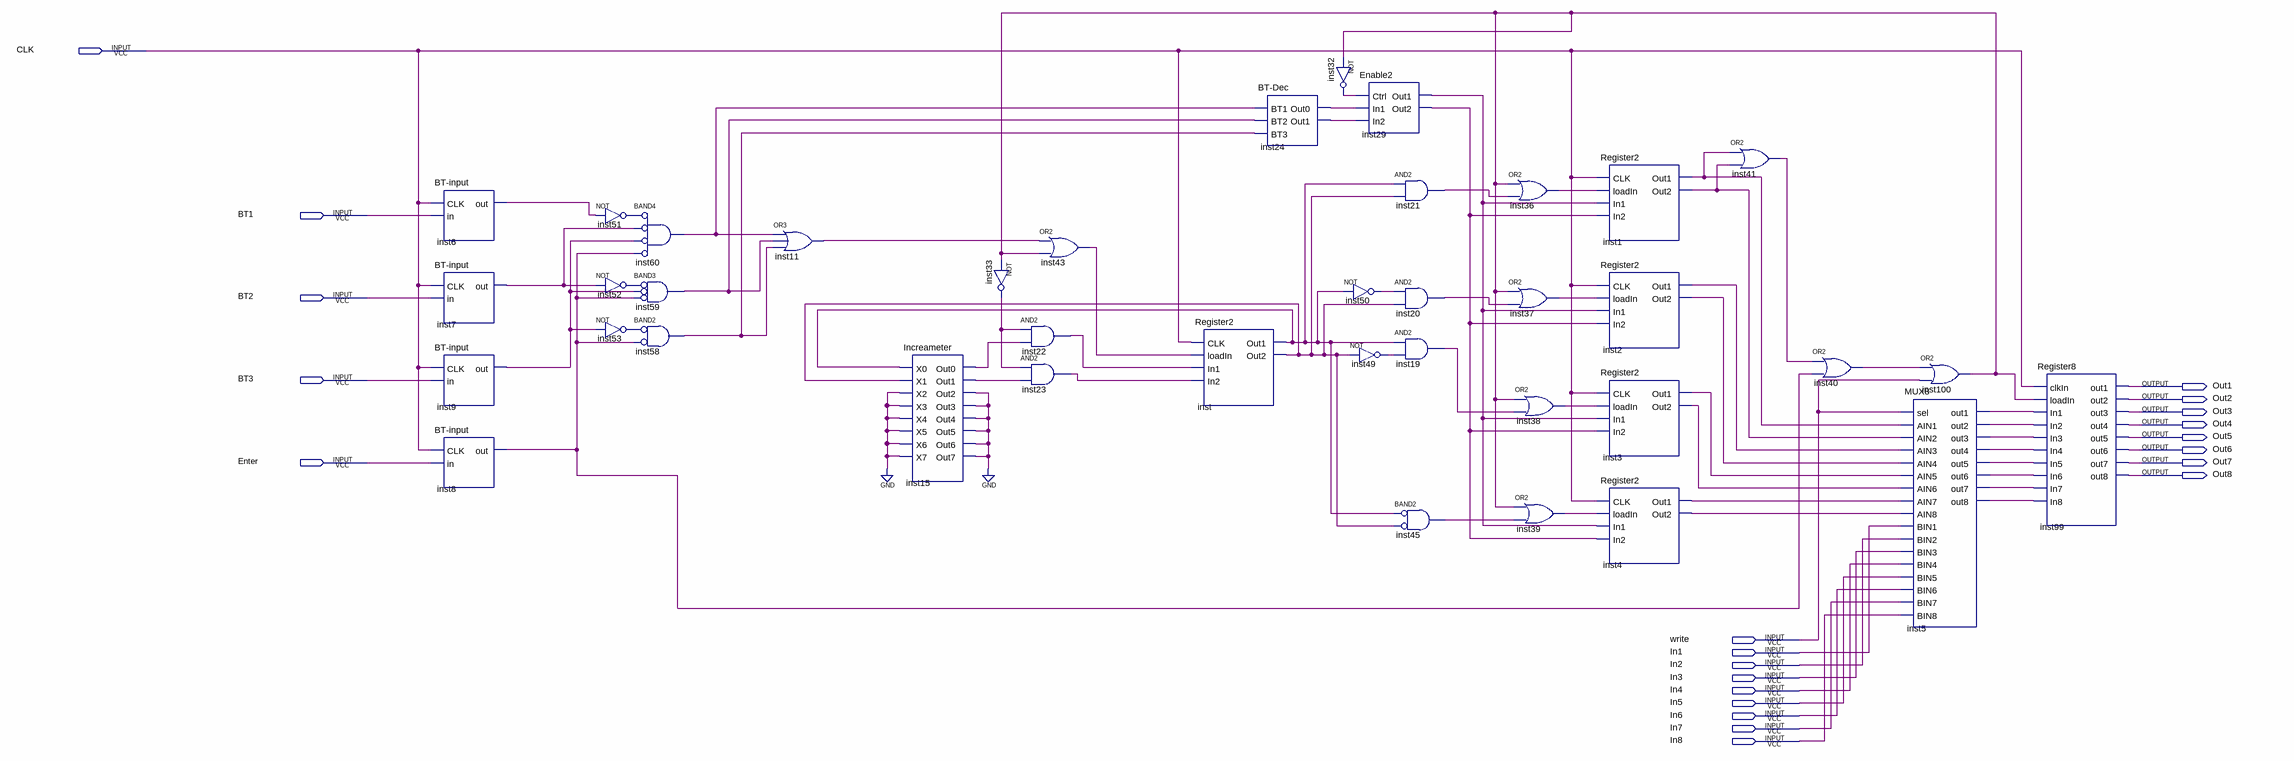
[diagram p0: schematic sheet]
// Quartus schematic InputDevice.bdf as structural Verilog: 39 symbols, 22 pins
module InputDevice (
  input  CLK,
  input  BT1,
  input  BT2,
  input  BT3,
  input  Enter,
  input  write,
  input  In1,
  input  In2,
  input  In3,
  input  In4,
  input  In5,
  input  In6,
  input  In7,
  input  In8,
  output Out1,
  output Out2,
  output Out3,
  output Out4,
  output Out5,
  output Out6,
  output Out7,
  output Out8
);

  wire inst1_out1, inst1_out2, inst2_out1, inst2_out2, inst3_out1, inst3_out2, inst4_out1, inst4_out2,
       inst5_out1, inst5_out2, inst5_out3, inst5_out4, inst5_out5, inst5_out6, inst5_out7, inst5_out8,
       inst6_out, inst7_out, inst8_out, inst9_out, inst11_out, inst15_out0, inst15_out1, inst15_out2,
       inst19_out, inst20_out, inst21_out, inst22_out, inst23_out, inst24_out0, inst24_out1, inst29_out1,
       inst29_out2, inst32_out, inst33_out, inst36_out, inst37_out, inst38_out, inst39_out, inst40_out,
       inst41_out, inst43_out, inst45_out, inst49_out, inst50_out, inst51_out, inst52_out, inst53_out,
       inst58_out, inst59_out, inst60_out, inst100_out, inst_out1, inst_out2;

  \BT-input  inst6 (.CLK(CLK), .in(BT1), .out(inst6_out));
  \BT-input  inst7 (.CLK(CLK), .in(BT2), .out(inst7_out));
  \BT-input  inst9 (.CLK(CLK), .in(BT3), .out(inst9_out));
  \BT-input  inst8 (.CLK(CLK), .in(Enter), .out(inst8_out));
  not inst51 (inst51_out, inst6_out);
  not inst52 (inst52_out, inst7_out);
  not inst53 (inst53_out, inst9_out);
  and inst60 (inst60_out, ~inst51_out, ~inst7_out, ~inst9_out, ~inst8_out);  // BAND4
  and inst59 (inst59_out, ~inst52_out, ~inst9_out, ~inst8_out);  // BAND3
  and inst58 (inst58_out, ~inst53_out, ~inst8_out);  // BAND2
  or inst11 (inst11_out, inst60_out, inst59_out, inst58_out);
  Increameter inst15 (
    .X0(inst_out1), .X1(inst_out2), .X2(1'b0), .X3(1'b0), .X4(1'b0), .X5(1'b0), .X6(1'b0), .X7(1'b0),
    .Out0(inst15_out0), .Out1(inst15_out1), .Out2(inst15_out2), .Out3(inst15_out2), .Out4(inst15_out2),
    .Out5(inst15_out2), .Out6(inst15_out2), .Out7(inst15_out2));
  not inst33 (inst33_out, inst100_out);
  and inst22 (inst22_out, inst33_out, inst15_out0);
  and inst23 (inst23_out, inst33_out, inst15_out1);
  or inst43 (inst43_out, inst11_out, inst100_out);
  Register2 inst (
    .CLK(CLK), .loadIn(inst43_out), .In1(inst22_out), .In2(inst23_out), .Out1(inst_out1), .Out2(inst_out2));
  \BT-Dec  inst24 (.BT1(inst60_out), .BT2(inst59_out), .BT3(inst58_out), .Out0(inst24_out0), .Out1(inst24_out1));
  not inst32 (inst32_out, inst100_out);
  Enable2 inst29 (.Ctrl(inst32_out), .In1(inst24_out0), .In2(inst24_out1), .Out1(inst29_out1), .Out2(inst29_out2));
  not inst50 (inst50_out, inst_out1);
  not inst49 (inst49_out, inst_out2);
  and inst21 (inst21_out, inst_out1, inst_out2);
  and inst20 (inst20_out, inst50_out, inst_out2);
  and inst19 (inst19_out, inst_out1, inst49_out);
  and inst45 (inst45_out, ~inst_out1, ~inst_out2);  // BAND2
  or inst36 (inst36_out, inst100_out, inst21_out);
  or inst37 (inst37_out, inst100_out, inst20_out);
  or inst38 (inst38_out, inst100_out, inst19_out);
  or inst39 (inst39_out, inst100_out, inst45_out);
  Register2 inst1 (
    .CLK(CLK), .loadIn(inst36_out), .In1(inst29_out1), .In2(inst29_out2), .Out1(inst1_out1), .Out2(inst1_out2));
  Register2 inst2 (
    .CLK(CLK), .loadIn(inst37_out), .In1(inst29_out1), .In2(inst29_out2), .Out1(inst2_out1), .Out2(inst2_out2));
  Register2 inst3 (
    .CLK(CLK), .loadIn(inst38_out), .In1(inst29_out1), .In2(inst29_out2), .Out1(inst3_out1), .Out2(inst3_out2));
  Register2 inst4 (
    .CLK(CLK), .loadIn(inst39_out), .In1(inst29_out1), .In2(inst29_out2), .Out1(inst4_out1), .Out2(inst4_out2));
  or inst41 (inst41_out, inst1_out1, inst1_out2);
  or inst40 (inst40_out, inst41_out, inst8_out);
  or inst100 (inst100_out, inst40_out, write);
  MUX8 inst5 (
    .sel(write), .AIN1(inst1_out1), .AIN2(inst1_out2), .AIN3(inst2_out1), .AIN4(inst2_out2),
    .AIN5(inst3_out1), .AIN6(inst3_out2), .AIN7(inst4_out1), .AIN8(inst4_out2), .BIN1(In1), .BIN2(In2),
    .BIN3(In3), .BIN4(In4), .BIN5(In5), .BIN6(In6), .BIN7(In7), .BIN8(In8), .out1(inst5_out1),
    .out2(inst5_out2), .out3(inst5_out3), .out4(inst5_out4), .out5(inst5_out5), .out6(inst5_out6),
    .out7(inst5_out7), .out8(inst5_out8));
  Register8 inst99 (
    .clkIn(CLK), .loadIn(inst100_out), .In1(inst5_out1), .In2(inst5_out2), .In3(inst5_out3),
    .In4(inst5_out4), .In5(inst5_out5), .In6(inst5_out6), .In7(inst5_out7), .In8(inst5_out8), .out1(Out1),
    .out2(Out2), .out3(Out3), .out4(Out4), .out5(Out5), .out6(Out6), .out7(Out7), .out8(Out8));
  // also tied to GND on the sheet: inst15_out2
endmodule
